# Altium schematic sheet DRL.SchDoc
size A4
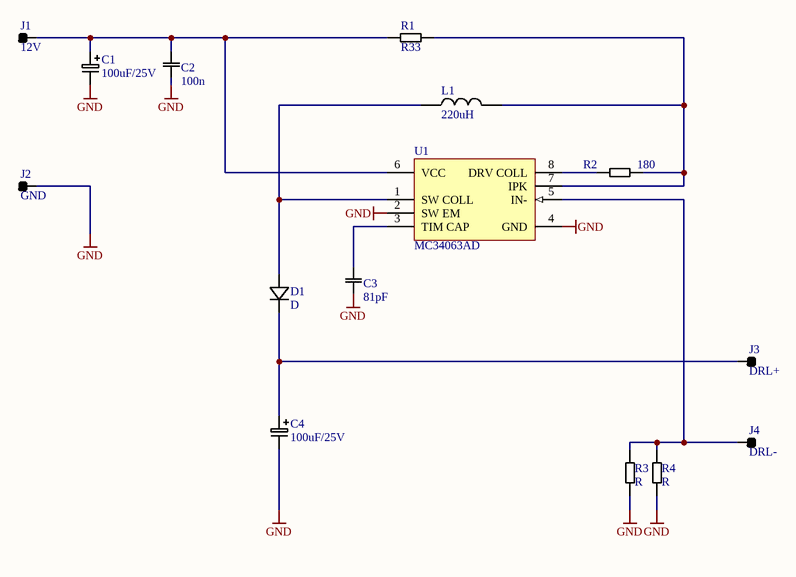
[diagram p0: DRL.SchDoc]

## Parts
C1  100uF/25V  [CAPC7238N]
C2  100n  [C0805]
C3  81pF  [C0805]
C4  100uF/25V  [CAPC7238N]
D1  D  [SMA]
J1  12V  [PIN]
J2  GND  [PIN]
J3  DRL+  [PIN]
J4  DRL-  [PIN]
L1  220uH  [IND Coilcraft]
R1  R33  [R1206]
R2  180  [R0805]
R3  R  [R1206]
R4  R  [R1206]
U1  MC34063AD  [SO8]

## Nets
GND: C1.2 C2.1 C3.1 C4.2 J2.1 R3.2 R4.2 U1.2(SW_EM) U1.4(GND)
NetC1_1: C1.1 C2.2 J1.1 R1.2 U1.6(VCC)
NetC3_2: C3.2 U1.3(TIM_CAP)
NetC4_1: C4.1 D1.C J3.1
NetD1_A: D1.A L1.1 U1.1(SW_COLL)
NetJ4_1: J4.1 R3.1 R4.1 U1.5(IN-)
NetL1_2: L1.2 R1.1 R2.1 U1.7(IPK)
NetR2_2: R2.2 U1.8(DRV_COLL)

## Notes on the sheet
- Title
- STMicroelectronics assumes no responsibility for the consequences of the use of this information
- Size:
- Date:
- Doc. Reference:
- A4
- Author:
- Time:
- Revision:
- Sheet
- of
- File:
- Created by:

## Library data of the parts
C1 C4 = C_EL: Supplier Part Number 1: Capacitor electrolytic, 50V, 5x11mm; Supplier 1: Farnell
C2 C3 = C: Supplier Part Number 1: any C0805 X7R 50V; Supplier 1: Farnell
J1-J4 = PIN: Supplier Part Number 1: Board-Board connector header, 1Way, 1Row; Supplier 1: Farnell; Supplier 2: Farnell; Supplier Part Number 2: 1835265
L1 = L
R1 R2 = R: Supplier Part Number 1: any R0805 1%; Supplier 1: Farnell
U1 = MC34063AD: DC-to-DC Converter Control Circuit; Published: 15-Apr-2002; LatestRevisionDate: 13-Apr-2006; LatestRevisionNote: IPC-7351 Footprint Added.; DatasheetVersion: 1996; PackageVersion: 1998; PackageReference: 751-05; Publisher: Altium Limited; PackageDescription: 8-Pin Small Outline Integrated Circuit 1.27 mm Pitch; Code_JEDEC: MS-012-AA; Code_IPC: SOIC127P600-8; ComponentLink1Description: Manufacturer Link; ComponentLink1URL: http://www.onsemi.com/site/products/taxonomy/0,4438,503,00.html; ComponentLink2Description: Datasheet; ComponentLink2URL: http://www.onsemi.com/pub/Collateral/MC34063A-D.PDF
D1 = D: Supplier 1: Farnell; Supplier Part Number 1: Diode type to be specified
R3 R4 = R: Supplier Part Number 1: any R0805 1%; Supplier 1: Farnell